# EAGLE design aq6 (EAGLE 6.5.0)
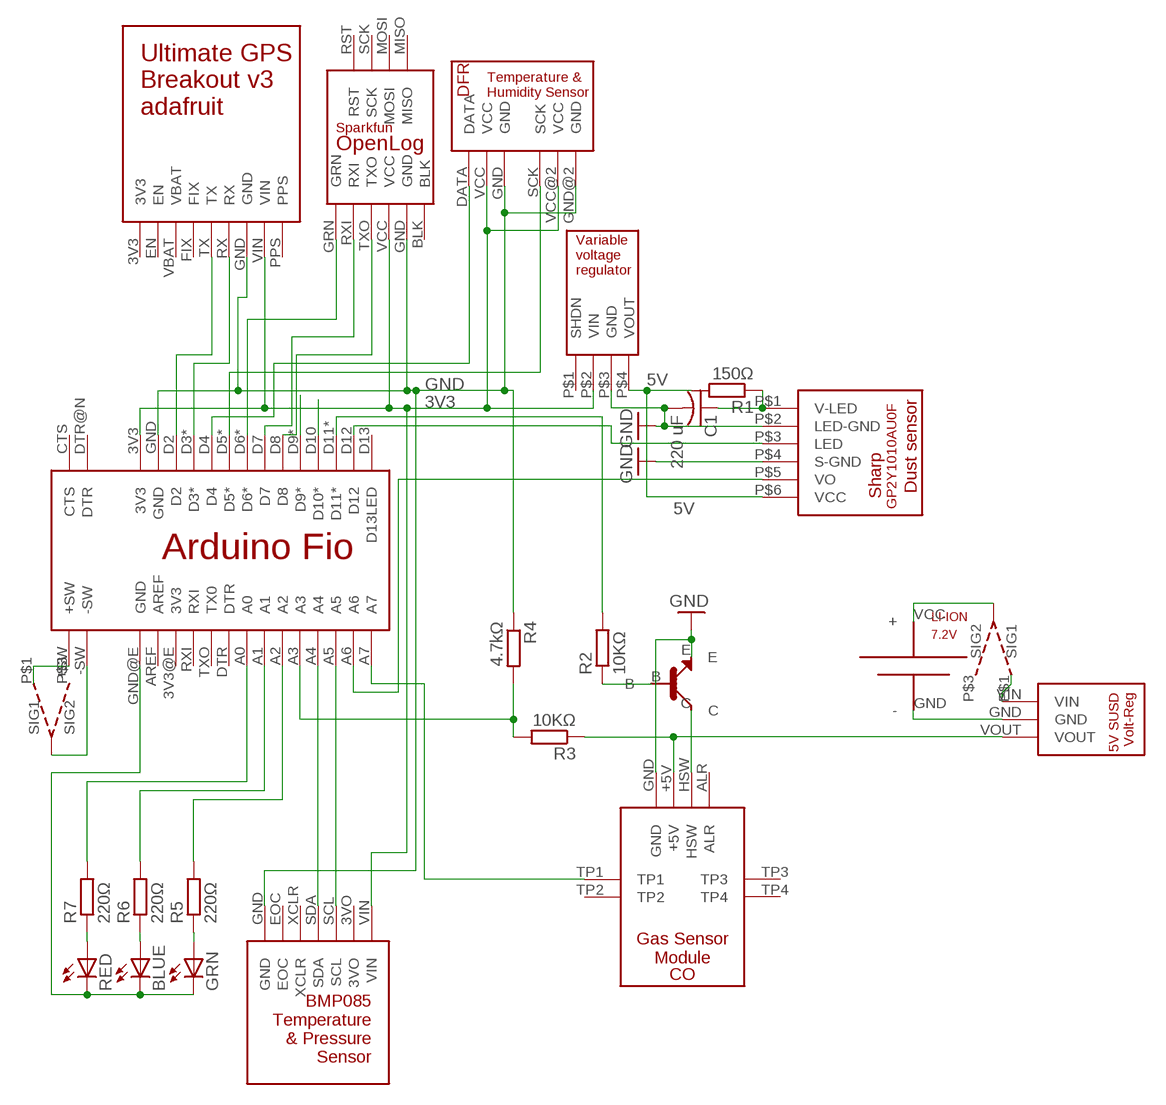
[diagram p0: schematic, sheet 1]

## Parts
BLUE  LED5MM  [LED5MM]
C1  220 uF  C-US050-025X075  [C050-025X075]
CO  CO  [GSM_PARALLAX]
GRN  LED5MM  [LED5MM]
LI-ION  7.2V  BATTERY_WITH_PCB_HOLES  [BATTERY_WITH_WIRE_HOLES]
R1  150Ω  R-EU_0207/15  [0207/15]
R2  10KΩ  R-EU_0204/7  [0204/7]
R3  10KΩ  R-EU_0204/7  [0204/7]
R4  4.7kΩ  R-EU_0204/7  [0204/7]
R5  220Ω  R-EU_0204/7  [0204/7]
R6  220Ω  R-EU_0204/7  [0204/7]
R7  220Ω  R-EU_0204/7  [0204/7]
RED  LED5MM  [LED5MM]
U$1  SHARP_DUST_SENSOR6PIN  [6PIN]
U$2  ARDUINO_FIO  [ARDUINO_FIO]
U$3  POLOLU_VAR_VOLTAGE_REG  [POLOLU_VAR_VOLTAGE_REG]
U$4  ADAFRUIT_GPS_V3  [ADAFRUIT_GPS_V3]
U$5  SPARKFUN_OPENLOG  [SPARKFUN_OPENLOG]
U$6  DFR_TEMP_HUMIDITY  [DFR_TEMP_HUMIDITY]
U$7  5V_SUSD_VOLT_REG  [5V_SUSD_VOLT_REG]
U$8  BMP085  [BMP085]
U$10  SWITCH  [SWITCH]
U$11  SWITCH  [SWITCH]
U$12  NPN  [NPN]

## Nets
3V3: U$2.3V3 U$3.P$2(VIN) U$4.VIN U$5.VCC U$6.VCC U$6.VCC@2(VCC) U$8.VIN
5V: R1.2 U$1.P$6(VCC) U$3.P$4(VOUT)
GND: BLUE.K(C) C1.2 CO.GND GRN.K(C) LI-ION.GND(-) R4.1 RED.K(C) U$1.P$2(LED-GND) U$1.P$4(S-GND) U$2.GND U$2.GND@E(GND) U$3.P$3(GND) U$4.GND U$5.GND U$6.GND U$6.GND@2(GND) U$7.GND U$8.GND U$12.E
N$1: U$1.P$3(LED) U$2.D12
N$2: C1.1 R1.1 U$1.P$1(V-LED)
N$3: U$1.P$5(VO) U$2.A6
N$4: U$2.D3* U$4.RX
N$5: U$2.D2 U$4.TX
N$6: U$2.+SW U$10.P$1(SIG1)
N$7: U$2.D6* U$5.GRN
N$8: U$2.D7 U$5.RXI
N$9: U$2.D8 U$5.TXO
N$10: U$2.-SW U$10.P$2(SIG_OUT)
N$11: LI-ION.VCC(+) U$11.P$2(SIG_OUT)
N$12: U$2.D5* U$6.SCK
N$13: U$2.D4 U$6.DATA
N$14: U$7.VIN U$11.P$1(SIG1)
N$15: R5.2 U$2.A2
N$16: R2.1 U$12.B
N$17: R2.2 U$2.D11*
N$18: CO.+5V R3.1 U$7.VOUT
N$19: CO.HSW U$12.C
N$20: CO.TP1 U$2.A7
N$21: R3.2 R4.2 U$2.A3
N$22: U$2.A4 U$8.SDA
N$23: U$2.A5 U$8.SCL
N$26: U$2.D10(D10*)
N$27: U$2.D9*
N$28: R7.2 U$2.A0
N$29: R6.2 U$2.A1
N$30: R7.1 RED.A
N$31: BLUE.A R6.1
N$32: GRN.A R5.1
Unconnected: CO.ALR CO.TP2 CO.TP3 CO.TP4 U$2.3V3@E(3V3) U$2.AREF U$2.CTS U$2.D13(D13LED) U$2.DTR U$2.DTR@N(DTR) U$2.RXI U$2.TXO(TX0) U$3.P$1(SHDN) U$4.3V3 U$4.EN U$4.FIX U$4.PPS U$4.VBAT U$5.BLK U$5.MISO U$5.MOSI U$5.RST U$5.SCK U$8.EOC U$8.XCLR U$10.P$3(SIG2) U$11.P$3(SIG2)

## Power pins joined to a net without a drawn wire
3VO: U$8.3VO

## Library data of the parts
BLUE GRN RED = adafruit:LED: LED OSRAM: - CHIPLED LG R971, LG N971, LY N971, LG Q971, LY Q971, LO R971, LY R971 LH N974, LH R974 LS Q976, LO Q976, LY Q976 LO Q996 - Hyper CHIPLED LW Q18S LB Q993, LB Q99A, LB R99A - SideLED LS A670, LO A670, LY A670, LG A670, LP A670 LB A673, LV A673, LT A673, LW A673 LH A674 LY A675 LS A676, LA A676, LO A676, LY A676, LW A676 LS A679, LY A679, LG A679 - Hyper Micro SIDELED® LS Y876, LA Y876, LO Y876, LY Y876 LT Y87S - SmartLED LW L88C, LW L88S LB L89C, LB L89S, LG L890 LS L89K, LO L89K, LY L89K LS L896, LA L896, LO L896, LY L896 - TOPLED LS T670, LO T670, LY T670, LG T670, LP T670 LSG T670, LSP T670, LSY T670, LOP T670, LYG T670 LG T671, LOG T671, LSG T671 LB T673, LV T673, LT T673, LW T673 LH T674 LS T676, LA T676, LO T676, LY T676, LB T676, LH T676, LSB T676, LW T676 LB T67C, LV T67C, LT T67C, LS T67K, LO T67K, LY T67K, LW E67C LS E67B, LA E67B, LO E67B, LY E67B, LB E67C, LV E67C, LT E67C LW T67C LS T679, LY T679, LG T679 LS T770, LO T770, LY T770, LG T770, LP T770 LB T773, LV T773, LT T773, LW T773 LH T774 LS E675, LA E675, LY E675, LS T675 LS T776, LA T776, LO T776, LY T776, LB T776 LHGB T686 LT T68C, LB T68C - Hyper Mini TOPLED® LB M676 - Mini TOPLED Santana® LG M470 LS M47K, LO M47K, LY M47K Source: http://www.osram.convergy.de/
C1 = resistor:C-US: CAPACITOR, American symbol
CO = air_quality_parts:CO
LI-ION = air_quality_parts:BATTERY_WITH_PCB_HOLES: Battery Displays where to drill holes to secure wires.
R1 = rcl:R-EU_: RESISTOR, European symbol
R2-R7 = resistor:R-EU_: RESISTOR, European symbol
U$1 = air_quality_parts:SHARP_DUST_SENSOR
U$2 = air_quality_parts:ARDUINO_FIO
U$3 = air_quality_parts:POLOLU_VAR_VOLTAGE_REG
U$4 = air_quality_parts:ADAFRUIT_GPS_V3
U$5 = air_quality_parts:SPARKFUN_OPENLOG
U$6 = air_quality_parts:DFR_TEMP_HUMIDITY: DFRobot's SHT10 Temperature and humidity sensor Has two sets of 3-wires running from breakout board.
U$7 = air_quality_parts:5V_SUSD_VOLT_REG: Pololu 5V SUSD voltage regulator http://www.pololu.com/product/2119/specs Produces 5 V from input voltages between 2.7 V and 11.8 V Typical efficiency of over 90%
U$8 = air_quality_parts:BMP085
U$10 U$11 = air_quality_parts:SWITCH
U$12 = air_quality_parts:NPN: NPN S9014

## Board
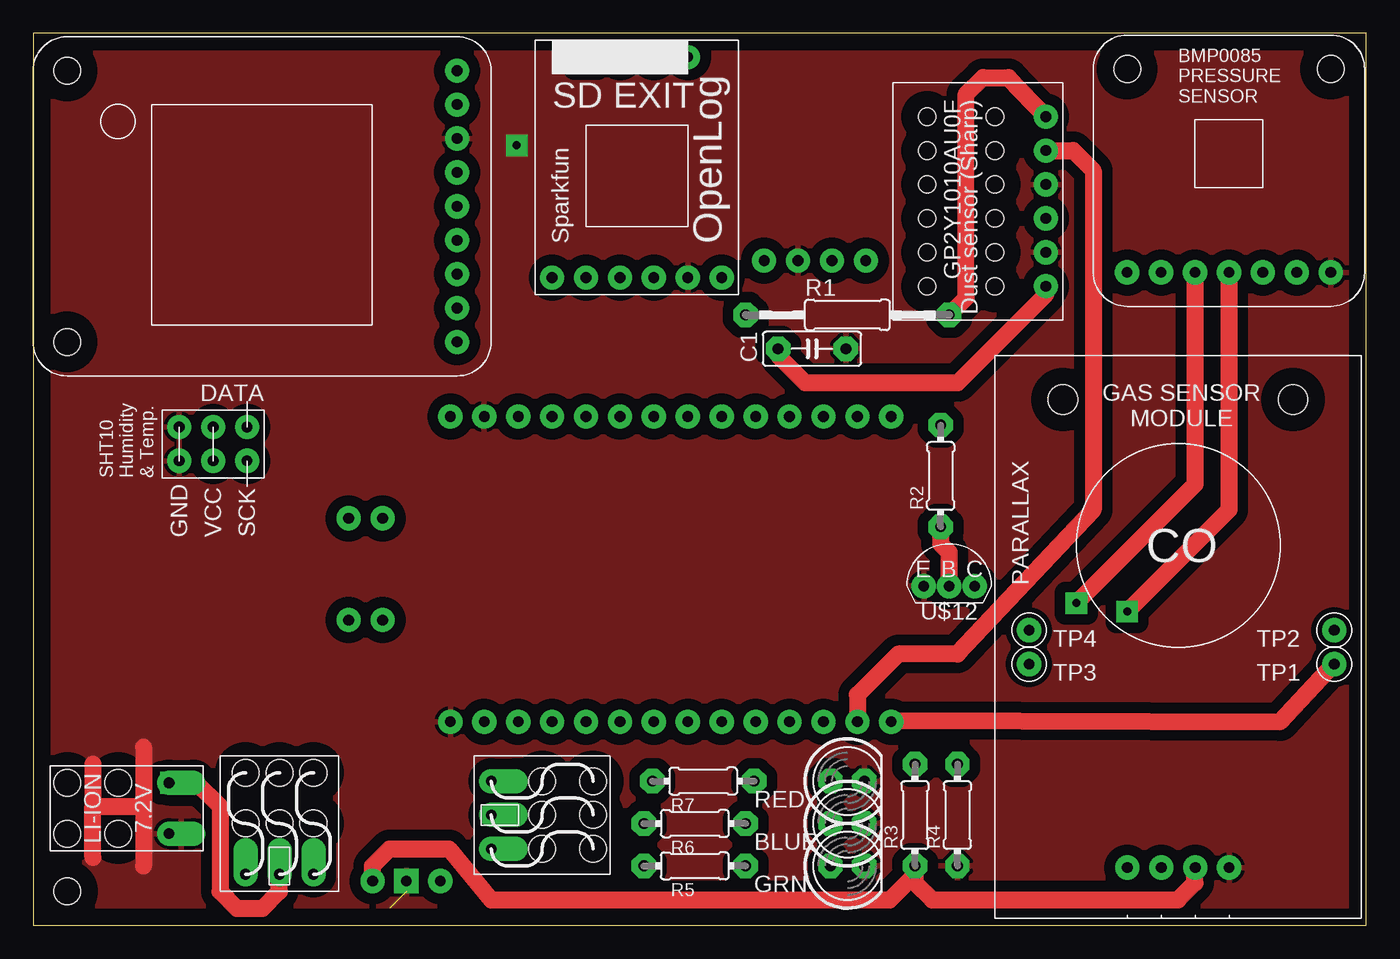
[diagram p1: board, top side]
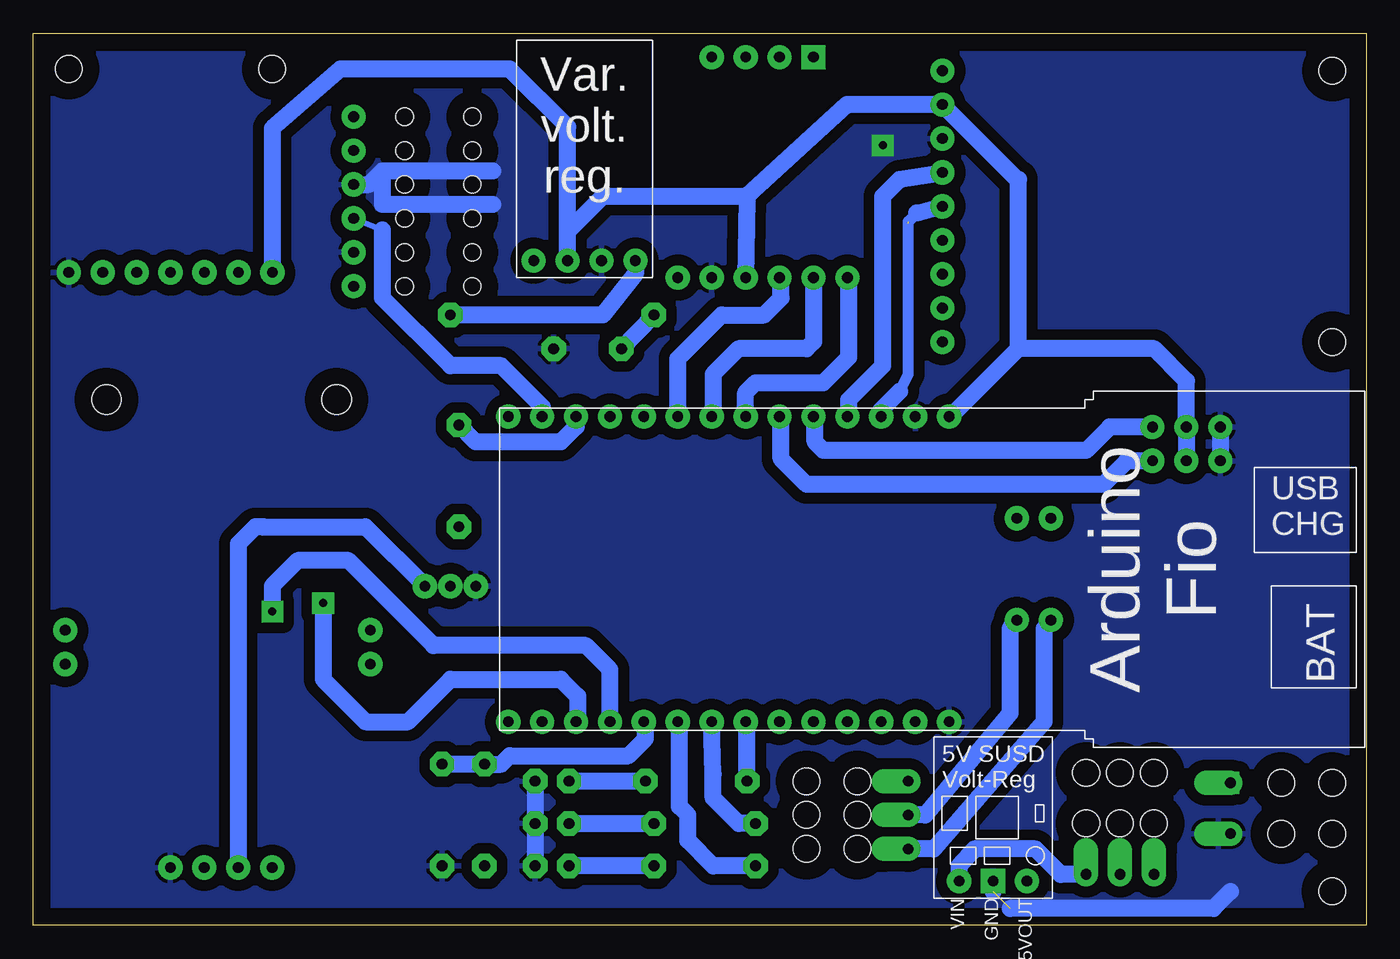
[diagram p2: board, bottom side, seen from below]

Size 99.81 x 66.8 mm. Coordinates in mm from the lower left corner, seen from the top.
Outline: 0,0 99.81,0 99.81,66.8 0,66.8 0,0
Copper layers (1*16): Top 0.035mm / dielectric 1.5mm / Bottom 0.035mm
Design rules "default *": minimum track width 10mil, minimum drill 24mil, track to track 8mil, track to pad 8mil, pad to pad 8mil, via to via 8mil, smd to smd 8mil, copper to edge 50mil, drill to drill 8mil, minimum pad ring 20mil, minimum via ring 20mil, stop-mask expansion 4mil, vias tented up to drill 0mil, thermal gap 10mil
Holes 2 mm at 2.54,2.54

### Footprints (pad centres in the part's own frame; a part is rotated, then mirrored left to right if it is on the bottom)
LED5MM = drill 0.813 pad 1.676 octagon: A -1.27,0; K 1.27,0
C050-025X075 = drill 0.813 octagon: 1 -2.54,0; 2 2.54,0
GSM_PARALLAX = drill 0.8: +5V 14.986,3.81; ALR 9.906,3.81; GND 17.526,3.81; HSW 12.446,3.81; TP1 25.4,19.05; TP2 25.4,21.59; TP3 2.54,19.05; TP4 2.54,21.59 | hole 2.2: 5.08,38.862; 22.301,38.862
BATTERY_WITH_WIRE_HOLES = drill 0.8 offset: GND 1.27,2.54; VCC 5.08,2.54 | hole 2: 1.27,6.35; 1.27,10.16; 5.08,10.16; 5.08,6.35
0207/15 = drill 0.813 octagon: 1 -7.62,0; 2 7.62,0
0204/7 = drill 0.813 octagon: 1 -3.81,0; 2 3.81,0
6PIN = drill 0.8: P$1 -5.08,6.35; P$2 -5.08,3.81; P$3 -5.08,1.27; P$4 -5.08,-1.27; P$5 -5.08,-3.81; P$6 -5.08,-6.35 | hole 1.3: -1.27,6.35; -1.27,3.81; -1.27,1.27; -1.27,-1.27; -1.27,-3.81; -1.27,-6.35; 3.81,-6.35; 3.81,-3.81; 3.81,-1.27; 3.81,1.27; 3.81,3.81; 3.81,6.35
ARDUINO_FIO = drill 0.8: 3V3 -10.16,2.54; 3V3@E 12.7,-2.54; +SW 5.08,10.16; -SW 5.08,7.62; A0 12.7,-12.7; A1 12.7,-15.24; A2 12.7,-17.78; A3 12.7,-20.32; A4 12.7,-22.86; A5 12.7,-25.4; A6 12.7,-27.94; A7 12.7,-30.48; AREF 12.7,0; CTS -2.54,10.16; D2 -10.16,-2.54; D3* -10.16,-5.08; D4 -10.16,-7.62; D5* -10.16,-10.16; D6* -10.16,-12.7; D7 -10.16,-15.24; D8 -10.16,-17.78; D9* -10.16,-20.32; D10 -10.16,-22.86; D11* -10.16,-25.4; D12 -10.16,-27.94; D13 -10.16,-30.48; DTR 12.7,-10.16; DTR@N -2.54,7.62; GND -10.16,0; GND@E 12.7,2.54; RXI 12.7,-5.08; TXO 12.7,-7.62
POLOLU_VAR_VOLTAGE_REG = drill 0.8: P$1 -3.81,-6.35; P$2 -1.27,-6.35; P$3 1.27,-6.35; P$4 3.81,-6.35
ADAFRUIT_GPS_V3 = drill 0.8: 3V3 2.54,2.54; EN 5.08,2.54; FIX 10.16,2.54; GND 17.78,2.54; PPS 22.86,2.54; RX 15.24,2.54; TX 12.7,2.54; VBAT 7.62,2.54; VIN 20.32,2.54 | hole 2: 2.54,31.75; 22.86,31.75
SPARKFUN_OPENLOG = drill 0.8: BLK 13.97,1.27; GND 11.43,1.27; GRN 1.27,1.27; MISO 11.43,17.78; MOSI 8.89,17.78; RXI 3.81,1.27; SCK 6.35,17.78; TXO 6.35,1.27; VCC 8.89,1.27 | drill 0.8 square: RST 3.81,17.78
DFR_TEMP_HUMIDITY = drill 0.8: DATA 1.27,-2.54; GND -1.27,2.54; GND@2 1.27,2.54; SCK -1.27,-2.54; VCC -1.27,0; VCC@2 1.27,0
5V_SUSD_VOLT_REG = drill 0.8 square: GND 4.445,1.27 | drill 0.8: VIN 1.905,1.27; VOUT 6.985,1.27
BMP085 = drill 0.8: 3VO 5.08,2.54; EOC 15.24,2.54; GND 17.78,2.54; SCL 7.62,2.54; SDA 10.16,2.54; VIN 2.54,2.54; XCLR 12.7,2.54 | hole 2: 2.54,17.78; 17.78,17.78
SWITCH = drill 0.8 offset: P$1 0,-1.27; P$2 2.54,-1.27; P$3 5.08,-1.27 | hole 2: 2.54,-5.08; 5.08,-5.08; 2.54,-8.89; 5.08,-8.89; 0,-5.08; 0,-8.89
NPN = drill 0.8: B 0,0; C 1.905,0; E -1.905,0

### Placement (x,y rotation side)
BLUE  60.96,7.62 0 top
C1  58.31,43.18 0 top
CO  72.02,0.51 0 top
GRN  60.96,4.45 0 top
LI-ION  12.7,5.59 90 top
R1  60.96,45.72 0 top
R2  67.94,33.66 90 top
R3  66.03,8.26 90 top
R4  69.2,8.26 90 top
R5  49.53,4.45 180 top
R6  49.53,7.62 180 top
R7  50.16,10.79 180 top
RED  60.96,10.79 0 top
U$1  70.74,54.21 180 top
U$2  33.77,27.94 270 bottom
U$3  58.53,56.13 0 bottom
U$4  34.27,41.15 90 top
U$5  37.58,47.24 0 top
U$6  13.46,36.05 90 top
U$7  32.38,2.03 0 bottom
U$8  79.38,46.35 0 top
U$10  33.02,5.71 90 top
U$11  20.97,2.54 180 top
U$12  68.58,25.4 0 top

### Tracks (layer width: path | path; a pad name or v marks a point on that pad's centre or on a via)
3V3
  Bottom 1.27: U$2.3V3 31.11,38.1 26.04,43.18 | 26.04,43.18 26.04,55.88 26.15,55.88 U$4.VIN 38.86,61.47 46.35,54.61 | 46.35,54.61 46.35,54.34 U$5.VCC | 59.8,51.96 57.15,54.61 46.35,54.61 | U$6.VCC U$6.VCC@2 13.46,40.77 15.88,43.18 26.04,43.18 | U$3.P$2 59.8,51.96 | 59.8,51.96 59.8,59.8 64.14,64.14 76.83,64.14 81.92,59.69 U$8.VIN
5V
  Top 1.27: R1.2 69.85,46.99 69.85,62.23 71.12,63.5 73.03,63.48 U$1.P$6
  Bottom 1.27: U$3.P$4 54.72,48.78 57.15,45.72 R1.2
GND  (via drill 0.6)  (1 unrouted)
  Top 1.27: 4.45,12.06 4.45,8.89 | 4.45,5.08 4.45,8.89 | 4.45,8.89 8.26,8.89 | 8.26,8.89 8.26,4.45 | 8.26,13.34 8.26,8.89
  Bottom 1.27: U$6.GND@2 U$6.GND | RED.K BLUE.K GRN.K | 10.16,2.54 11.43,1.27 26.67,1.27 | 27.94,2.54 U$7.GND | 73.66,56.52 65.41,56.52 | 65.41,53.98 73.66,53.98 73.66,56.52 | U$1.P$4 74.69,55.48 73.66,56.52
  other vias: 36.2,58.42
  pour Top (isolate 0.813): 0.64,66.04 0.64,0.64 99.06,0.64 99.06,66.04
  pour Bottom (isolate 0.813): 0.64,66.04 99.06,66.04 99.06,0.64 0.64,0.64
N$1
  Bottom 0.406: 73.66,52.07 U$1.P$3
  Bottom 1.27: U$2.D12 61.71,38.85 64.77,41.91 68.58,41.91 73.66,46.99 73.66,52.07
N$2
  Top 1.27: U$1.P$1 75.82,47.24 75.56,46.99 69.23,40.64 57.78,40.64 55.88,42.55 C1.1
  Bottom 1.27: C1.1 R1.1
N$3
  Top 1.27: U$2.A6 61.71,17.26 64.77,20.32 69.22,20.32 79.38,31.11 79.38,56.52 77.87,58.02 U$1.P$5
N$4
  Bottom 1.27: U$2.D3* 38.73,38.1 38.73,39.37 36.2,41.91 36.2,54.61 34.92,55.88 U$4.RX
N$5  (1 unrouted)
  Bottom 0.813: 34.92,40.01 34.29,41.27 34.29,52.56 | 34.29,52.7 33.66,53.34
  Bottom 1.27: U$2.D2 36.31,38.62 34.92,40.01 | 33.66,53.34 U$4.TX
N$6
  Bottom 1.27: U$2.+SW 23.61,22.75 24.13,22.23 24.13,15.24 32.38,5.71 U$10.P$1
N$7
  Bottom 1.27: U$2.D6* 46.47,39.89 45.72,40.64 40.64,40.64 38.73,42.55 38.73,48.4 U$5.GRN
N$8
  Bottom 1.27: U$5.RXI 41.39,43.7 41.91,43.18 46.99,43.18 48.9,41.27 48.9,38.21 U$2.D7
N$9
  Bottom 1.27: U$2.D8 51.55,42.43 48.26,45.72 45.09,45.72 43.81,46.99 43.81,48.4 U$5.TXO
N$10
  Bottom 1.27: U$10.P$2 33.02,8.26 26.67,15.88 26.67,22.23 26.56,22.34 26.56,22.45 U$2.-SW
N$11  (via drill 0.6)
  Top 1.27: v10.29,10.67 12.06,10.79 13.97,8.89 13.97,2.54 15.24,1.27 17.16,1.27 17.16,1.28 18.41,2.54 U$11.P$2
  Bottom 1.27: LI-ION.VCC v10.29,10.67
N$12
  Bottom 1.27: U$6.SCK 17.92,34.78 19.68,33.02 41.91,33.02 43.81,34.92 43.81,37.99 U$2.D5*
N$13
  Bottom 1.27: U$6.DATA 19.19,37.32 20.95,35.56 40.64,35.56 41.27,36.2 41.27,37.99 U$2.D4
N$14
  Bottom 1.27: U$11.P$1 22.86,3.81 24.77,5.71 29.34,5.71 30.48,4.45 U$7.VIN
N$15
  Bottom 1.27: R5.2 48.9,4.45 50.8,6.35 50.8,8.26 51.44,8.89 51.44,15.13 U$2.A2
N$16
  Top 1.27: R2.1 67.94,28.57 68.58,27.94 U$12.B
N$17
  Bottom 1.27: U$2.D11* 59.17,37.35 60.33,36.2 66.67,36.2 R2.2
N$18
  Top 1.27: 25.4,3.17 U$7.VOUT 25.4,4.45 26.67,5.71 31.11,5.71 34.29,1.91 64.14,1.91 66.03,3.79 R3.1 66.03,3.19 67.31,1.91 85.72,1.91 87,3.17 87,4.3 CO.+5V
N$19
  Bottom 1.27: 82.56,29.83 82.55,29.84 | 82.55,29.84 74.93,29.84 U$12.C | 82.55,29.84 83.19,29.84 84.45,28.57 84.45,4.33 CO.HSW
N$20
  Top 1.27: U$2.A7 64.25,15.35 93.34,15.24 96.92,19.05 CO.TP1
N$21
  Bottom 1.27: R4.2 R3.2 64.77,12.06 64.14,12.7 55.24,12.7 53.98,13.97 53.98,15.13 U$2.A3
N$22  (via drill 0.6)
  Top 1.27: U$8.SDA 89.53,31.11 v81.92,23.5
  Bottom 1.27: U$2.A4 56.63,19.16 58.42,20.95 69.85,20.95 76.2,27.3 80.01,27.3 81.92,25.4 v81.92,23.5
N$23  (via drill 0.6)
  Top 1.27: U$8.SCL 87,33.02 v78.11,24.13
  Bottom 1.27: v78.11,24.13 78.11,18.41 74.93,15.24 71.75,15.24 68.58,18.41 60.33,18.41 59.05,17.14 59.05,15.35 U$2.A5
N$28
  Bottom 1.27: R7.2 46.35,15.13 U$2.A0
N$29
  Bottom 1.27: R6.2 46.99,7.62 48.9,9.53 48.9,11.32 U$2.A1
N$30
  Bottom 1.27: R7.1 RED.A
N$31
  Bottom 1.27: BLUE.A R6.1
N$32
  Bottom 1.27: R5.1 GRN.A